# EAGLE design tranwithatmega1.0 (EAGLE 9.5.0)
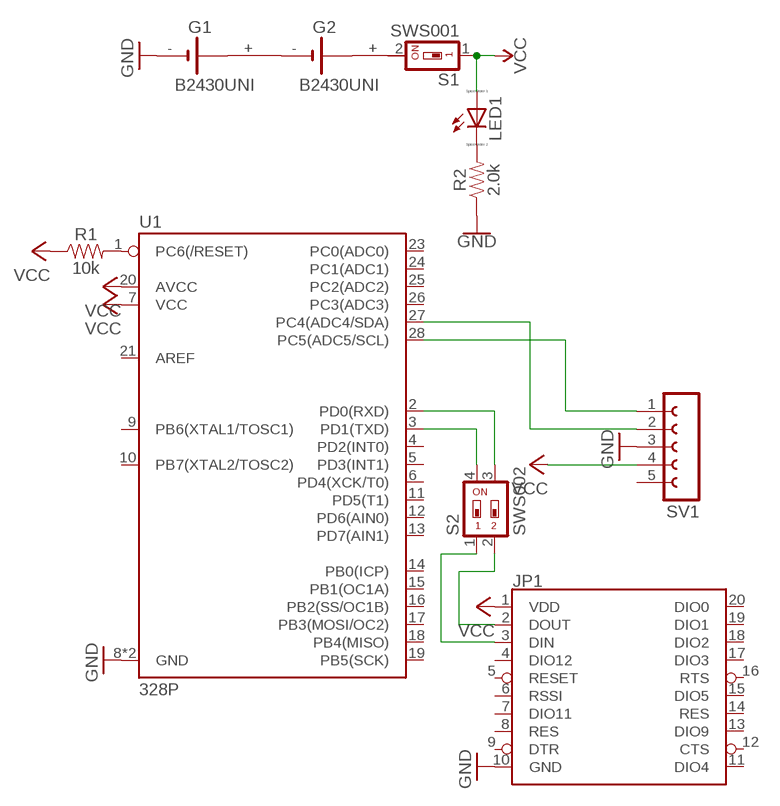
[diagram p0: schematic, sheet 1]

## Parts
G1  B2430UNI  [B2430UNI]
G2  B2430UNI  [B2430UNI]
JP1  XBEE  [XBEE]
LED1  LED_E  [LED_1206]
R1  10k  10KOHM-HORIZ-1/4W-1%  [AXIAL-0.3]
R2  2.0k  2.0KOHM-0603-1/10W-5%  [0603]
S1  SWS001  [SMS-001]
S2  SWS002  [SMS-002]
SV1  FE05-1  [FE05-1]
U1  328P  ATMEGA328P_PDIP  [DIP28]

## Nets
GND: G1.- JP1.10(GND) R2.1 SV1.3 U1.8(GND) U1.22(GND)
N$1: R1.P$2 U1.1(PC6(/RESET))
N$2: SV1.1 U1.28(PC5(ADC5/SCL))
N$3: SV1.2 U1.27(PC4(ADC4/SDA))
N$4: S2.3 U1.2(PD0(RXD))
N$5: JP1.3(DIN) S2.1
N$6: G1.+ G2.-
N$7: G2.+@1(+) S1.2
N$8: S2.4 U1.3(PD1(TXD))
N$9: JP1.2(DOUT) S2.2
N$10: LED1.C R2.2
VCC: JP1.1(VDD) LED1.A R1.P$1 S1.1 SV1.4 U1.7(VCC) U1.20(AVCC)
Unconnected: G1.+@1(+) G1.+@2(+) G1.+@3(+) G1.+@4(+) G1.-@1(-) G2.+ G2.+@2(+) G2.+@3(+) G2.+@4(+) G2.-@1(-) JP1.4(DIO12) JP1.5(RESET) JP1.6(RSSI) JP1.7(DIO11) JP1.8(RES) JP1.9(DTR) JP1.11(DIO4) JP1.12(CTS) JP1.13(DIO9) JP1.14(RES) JP1.15(DIO5) JP1.16(RTS) JP1.17(DIO3) JP1.18(DIO2) JP1.19(DIO1) JP1.20(DIO0) SV1.5 U1.4(PD2(INT0)) U1.5(PD3(INT1)) U1.6(PD4(XCK/T0)) U1.9(PB6(XTAL1/TOSC1)) U1.10(PB7(XTAL2/TOSC2)) U1.11(PD5(T1)) U1.12(PD6(AIN0)) U1.13(PD7(AIN1)) U1.14(PB0(ICP)) U1.15(PB1(OC1A)) U1.16(PB2(SS/OC1B)) U1.17(PB3(MOSI/OC2)) U1.18(PB4(MISO)) U1.19(PB5(SCK)) U1.21(AREF) U1.23(PC0(ADC0)) U1.24(PC1(ADC1)) U1.25(PC2(ADC2)) U1.26(PC3(ADC3))

## Library data of the parts
G1 G2 = battery:B2430UNI: LI BATTERY
JP1 = SparkFun-RF:XBEE: Digi XBee and XBee Pro XBees are tiny blue chips that can communicate wirelessly with each other. They can do simple things, like replacing a couple of wires in serial communication, which is nice when you want to make a remote for your paintball vehicle. SparkFun Products SparkFun XBee Buying Guide <https://www.sparkfun.com/pages/xbee_guide> SparkFun XBee Explorer USB <https://www.sparkfun.com/products/11812> (WRL-11812) Breakout Board for XBee Module <https://www.sparkfun.com/products/8276> (WRL-8276) SparkFun XBee Explorer Regulated <https://www.sparkfun.com/products/11373> (WRL-11373) SparkFun XBee Explorer Dongle <https://www.sparkfun.com/products/11697> (WRL-11697) SparkFun XBee Shield <https://www.sparkfun.com/products/12847> (WRL-12847) SparkFun XBee Explorer Serial <https://www.sparkfun.com/products/13225> (WRL-13225)
LED1 = eagle-ltspice:LED_E: LED Source: http://www.osram.convergy.de Source: www.luxeon.com Source: www.kingbright.com; SPICEMODEL: NONE; SPICEPREFIX: D; SPICETYPE: diode
R1 = SparkFun-Resistors:10KOHM: 10kΩ resistor A resistor is a passive two-terminal electrical component that implements electrical resistance as a circuit element. Resistors act to reduce current flow, and, at the same time, act to lower voltage levels within circuits. - Wikipedia; PROD_ID: RES-12183
R2 = SparkFun-Resistors:2.0KOHM: 2kΩ resistor A resistor is a passive two-terminal electrical component that implements electrical resistance as a circuit element. Resistors act to reduce current flow, and, at the same time, act to lower voltage levels within circuits. - Wikipedia; PROD_ID: RES-08296
S1 = smd-special:SWS001: SMD Dip Switch 1 pol.
S2 = smd-special:SWS002: SMD Dip Switch 2 pol.
SV1 = con-lsta:FE05-1: FEMALE HEADER; OC_FARNELL: unknown; OC_NEWARK: unknown
U1 = SparkFun-IC-Microcontroller:ATMEGA328P_PDIP: Atmel 328P Through hole ATMEGA328P uC used in the Arduino 32kb flash, 1k EEPROM, 2k SRAM Datasheet <http://www.sparkfun.com/datasheets/Components/SMD/ATMega328.pdf> SparkFun Products Storefront component: AVR 28 Pin 20MHz 32K 6A/D - ATMega328P <https://www.sparkfun.com/products/9061> (COM-09061) SparkFun Simon Says - Through-Hole Soldering Kit <https://www.sparkfun.com/products/10547> (KIT-10547) SparkFun Learn to Solder - Simon Says <https://www.sparkfun.com/products/13708> (KIT-13708) SparkFun BigTime Watch Kit <https://www.sparkfun.com/products/11734> (KIT-11734) SparkFun ClockIt <https://www.sparkfun.com/products/10930> (KIT-10930) SparkFun Serial Enabled LCD Kit <https://www.sparkfun.com/products/10097> (LCD-10097) SparkFun Simon Tilts - Through Hole Soldering Kit <https://www.sparkfun.com/products/12634> (KIT-12634) SparkFun Frequency Counter Kit <https://www.sparkfun.com/products/10140> (KIT-10140) FabFM Radio Kit <https://www.sparkfun.com/products/11043> (KIT-11043) SparkFun Binary Blaster Kit <https://www.sparkfun.com/products/12037> (KIT-12037) SparkFun Metro-Gnome <https://www.sparkfun.com/products/9236> (KIT-09236) ATmega328 with Arduino Optiboot (Uno) <https://www.sparkfun.com/products/10524> (DEV-10524); PROD_ID: IC-09136

## Board
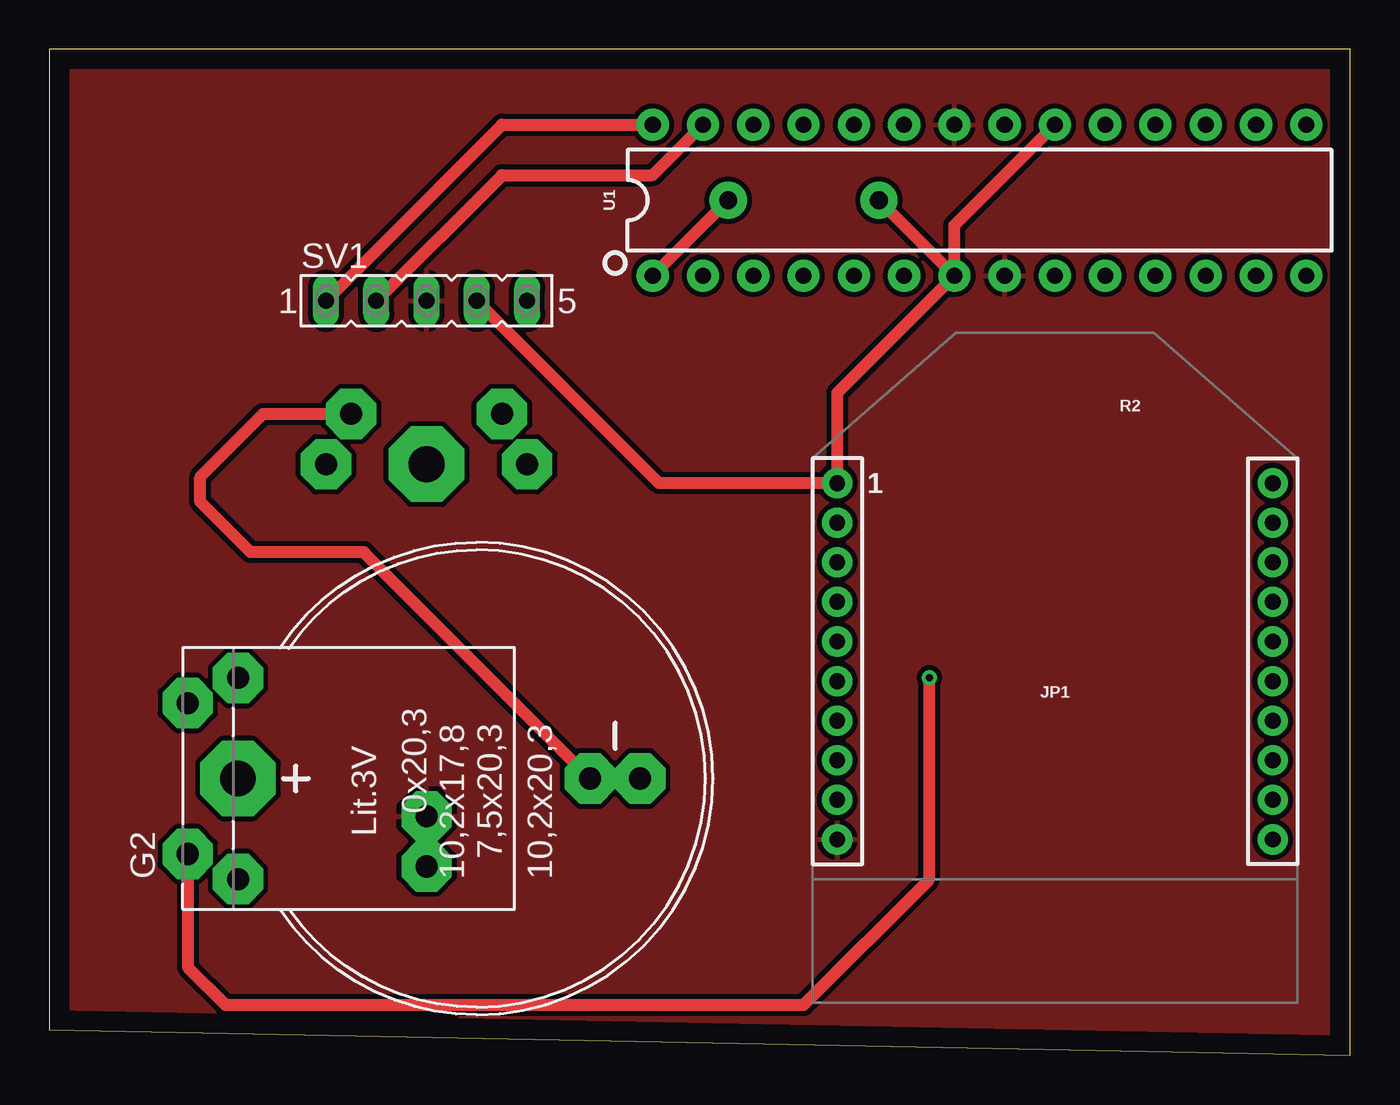
[diagram p1: board, top side]
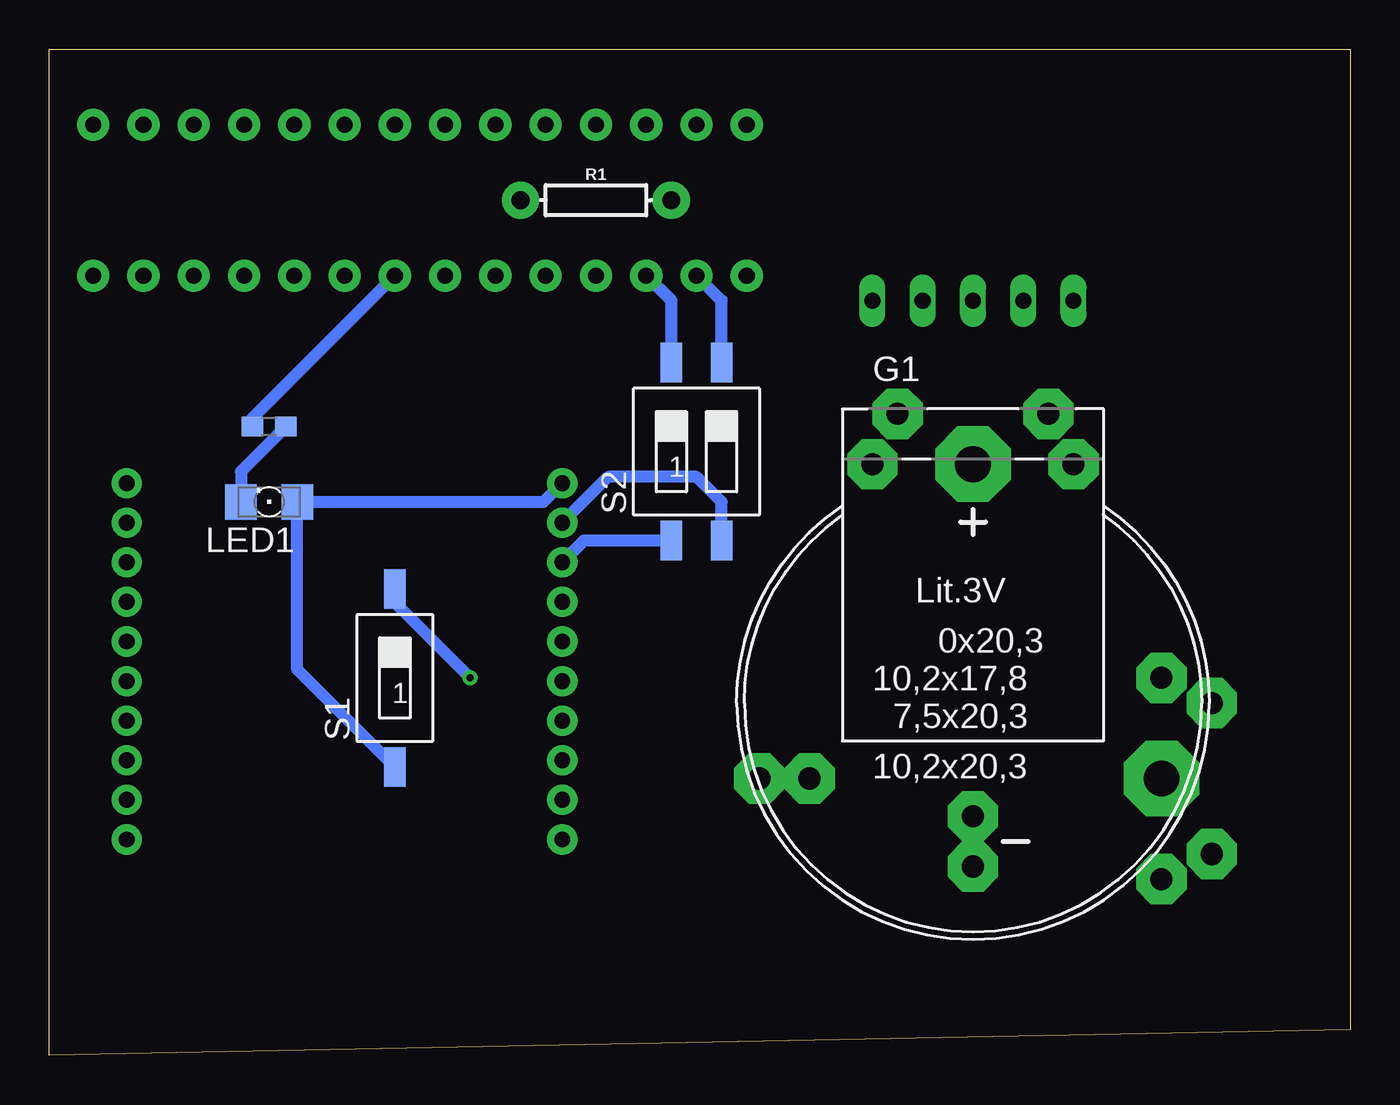
[diagram p2: board, bottom side, seen from below]

Size 65.71 x 50.79 mm. Coordinates in mm from the lower left corner, seen from the top.
Outline: 0,1.27 65.71,0 65.71,50.79 0,50.79 0,1.27
Copper layers (1*16): Top 0.035mm / dielectric 1.5mm / Bottom 0.035mm
Design rules "default": minimum track width 6mil, minimum drill 0.35mm, track to track 6mil, track to pad 6mil, pad to pad 6mil, via to via 6mil, smd to smd 6mil, copper to edge 40mil, drill to drill 6mil, minimum pad ring 10mil, minimum via ring 8mil, stop-mask expansion 4mil, vias tented up to drill 0mil, thermal gap 10mil

### Footprints (pad centres in the part's own frame; a part is rotated, then mirrored left to right if it is on the bottom)
B2430UNI = drill 1.118 pad 2.54 octagon: + 3.81,14.605; +@1 -3.81,14.605; +@2 -5.08,12.065; +@3 5.08,12.065; - 0,-5.715; -@1 0,-8.255 | drill 1.803 pad 3.81 octagon: +@4 0,12.065
XBEE = drill 0.8 pad 1.524: 1 -11,20; 2 -11,18; 3 -11,16; 4 -11,14; 5 -11,12; 6 -11,10; 7 -11,8; 8 -11,6; 9 -11,4; 10 -11,2; 11 11,2; 12 11,4; 13 11,6; 14 11,8; 15 11,10; 16 11,12; 17 11,14; 18 11,16; 19 11,18; 20 11,20
LED_1206 = smd 1.6 x 1.803: A -1.422,0; C 1.422,0
AXIAL-0.3 = drill 0.9 pad 1.88: P$1 -3.81,0; P$2 3.81,0
0603 = smd 1.1 x 1: 1 -0.85,0; 2 0.85,0
SMS-001 = smd 1.092 x 2.007: 1 0,-4.496; 2 0,4.496
SMS-002 = smd 1.092 x 2.007: 1 -1.27,-4.496; 2 1.27,-4.496; 3 1.27,4.496; 4 -1.27,4.496
FE05-1 = drill 0.813 long: 1 -5.08,0; 2 -2.54,0; 3 0,0; 4 2.54,0; 5 5.08,0
DIP28 = drill 0.813 pad 1.626: 1 -16.51,-3.81; 2 -13.97,-3.81; 3 -11.43,-3.81; 4 -8.89,-3.81; 5 -6.35,-3.81; 6 -3.81,-3.81; 7 -1.27,-3.81; 8 1.27,-3.81; 9 3.81,-3.81; 10 6.35,-3.81; 11 8.89,-3.81; 12 11.43,-3.81; 13 13.97,-3.81; 14 16.51,-3.81; 15 16.51,3.81; 16 13.97,3.81; 17 11.43,3.81; 18 8.89,3.81; 19 6.35,3.81; 20 3.81,3.81; 21 1.27,3.81; 22 -1.27,3.81; 23 -3.81,3.81; 24 -6.35,3.81; 25 -8.89,3.81; 26 -11.43,3.81; 27 -13.97,3.81; 28 -16.51,3.81

### Placement (x,y rotation side)
G1  19.05,17.78 0 bottom
G2  21.59,13.97 90 top
JP1  50.8,8.89 0 top
LED1  54.61,27.94 180 bottom
R1  38.1,43.18 0 bottom
R2  54.61,31.75 0 bottom
S1  48.26,19.05 0 bottom
S2  33.02,30.48 0 bottom
SV1  19.05,38.1 0 top
U1  46.99,43.18 0 top

### Tracks (layer width: path | path; a pad name or v marks a point on that pad's centre or on a via)
GND
  Bottom 0.61: U1.8 55.46,32.17 R2.1
  pour Top (isolate 0.254): 0,0 0,52.07 66.04,52.07 66.04,0
N$1
  Top 0.61: U1.1 R1.P$2
N$2
  Top 0.61: SV1.1 22.86,46.99 U1.28
N$3
  Top 0.61: SV1.2 22.86,44.45 30.48,44.45 U1.27
N$4
  Bottom 0.61: S2.3 31.75,38.1 U1.2
N$5
  Bottom 0.61: S2.1 38.71,25.98 JP1.3
N$6
  Top 0.61: G2.- 15.88,25.4 10.16,25.4 7.62,27.94 7.62,29.21 10.8,32.38 G1.+
N$7  (via drill 0.35)
  Top 0.61: G2.+@1 6.98,4.45 8.89,2.54 38.1,2.54 44.45,8.89 v44.45,19.05
  Bottom 0.61: v44.45,19.05 48.26,22.86 S1.2
N$8
  Bottom 0.61: S2.4 34.29,38.1 U1.3
N$9
  Bottom 0.61: S2.2 31.75,27.94 33.02,29.21 37.48,29.21 JP1.2
N$10
  Bottom 0.61: R2.2 56.03,29.48 LED1.C
VCC
  Top 0.61: R1.P$1 U1.7 | U1.7 45.72,41.91 U1.20 | U1.7 39.8,33.45 JP1.1 30.8,28.89 SV1.4
  Bottom 0.61: JP1.1 40.75,27.94 LED1.A 53.19,19.48 S1.1